# EAGLE schematic motor-nxp-app-notes (EAGLE 6.4)
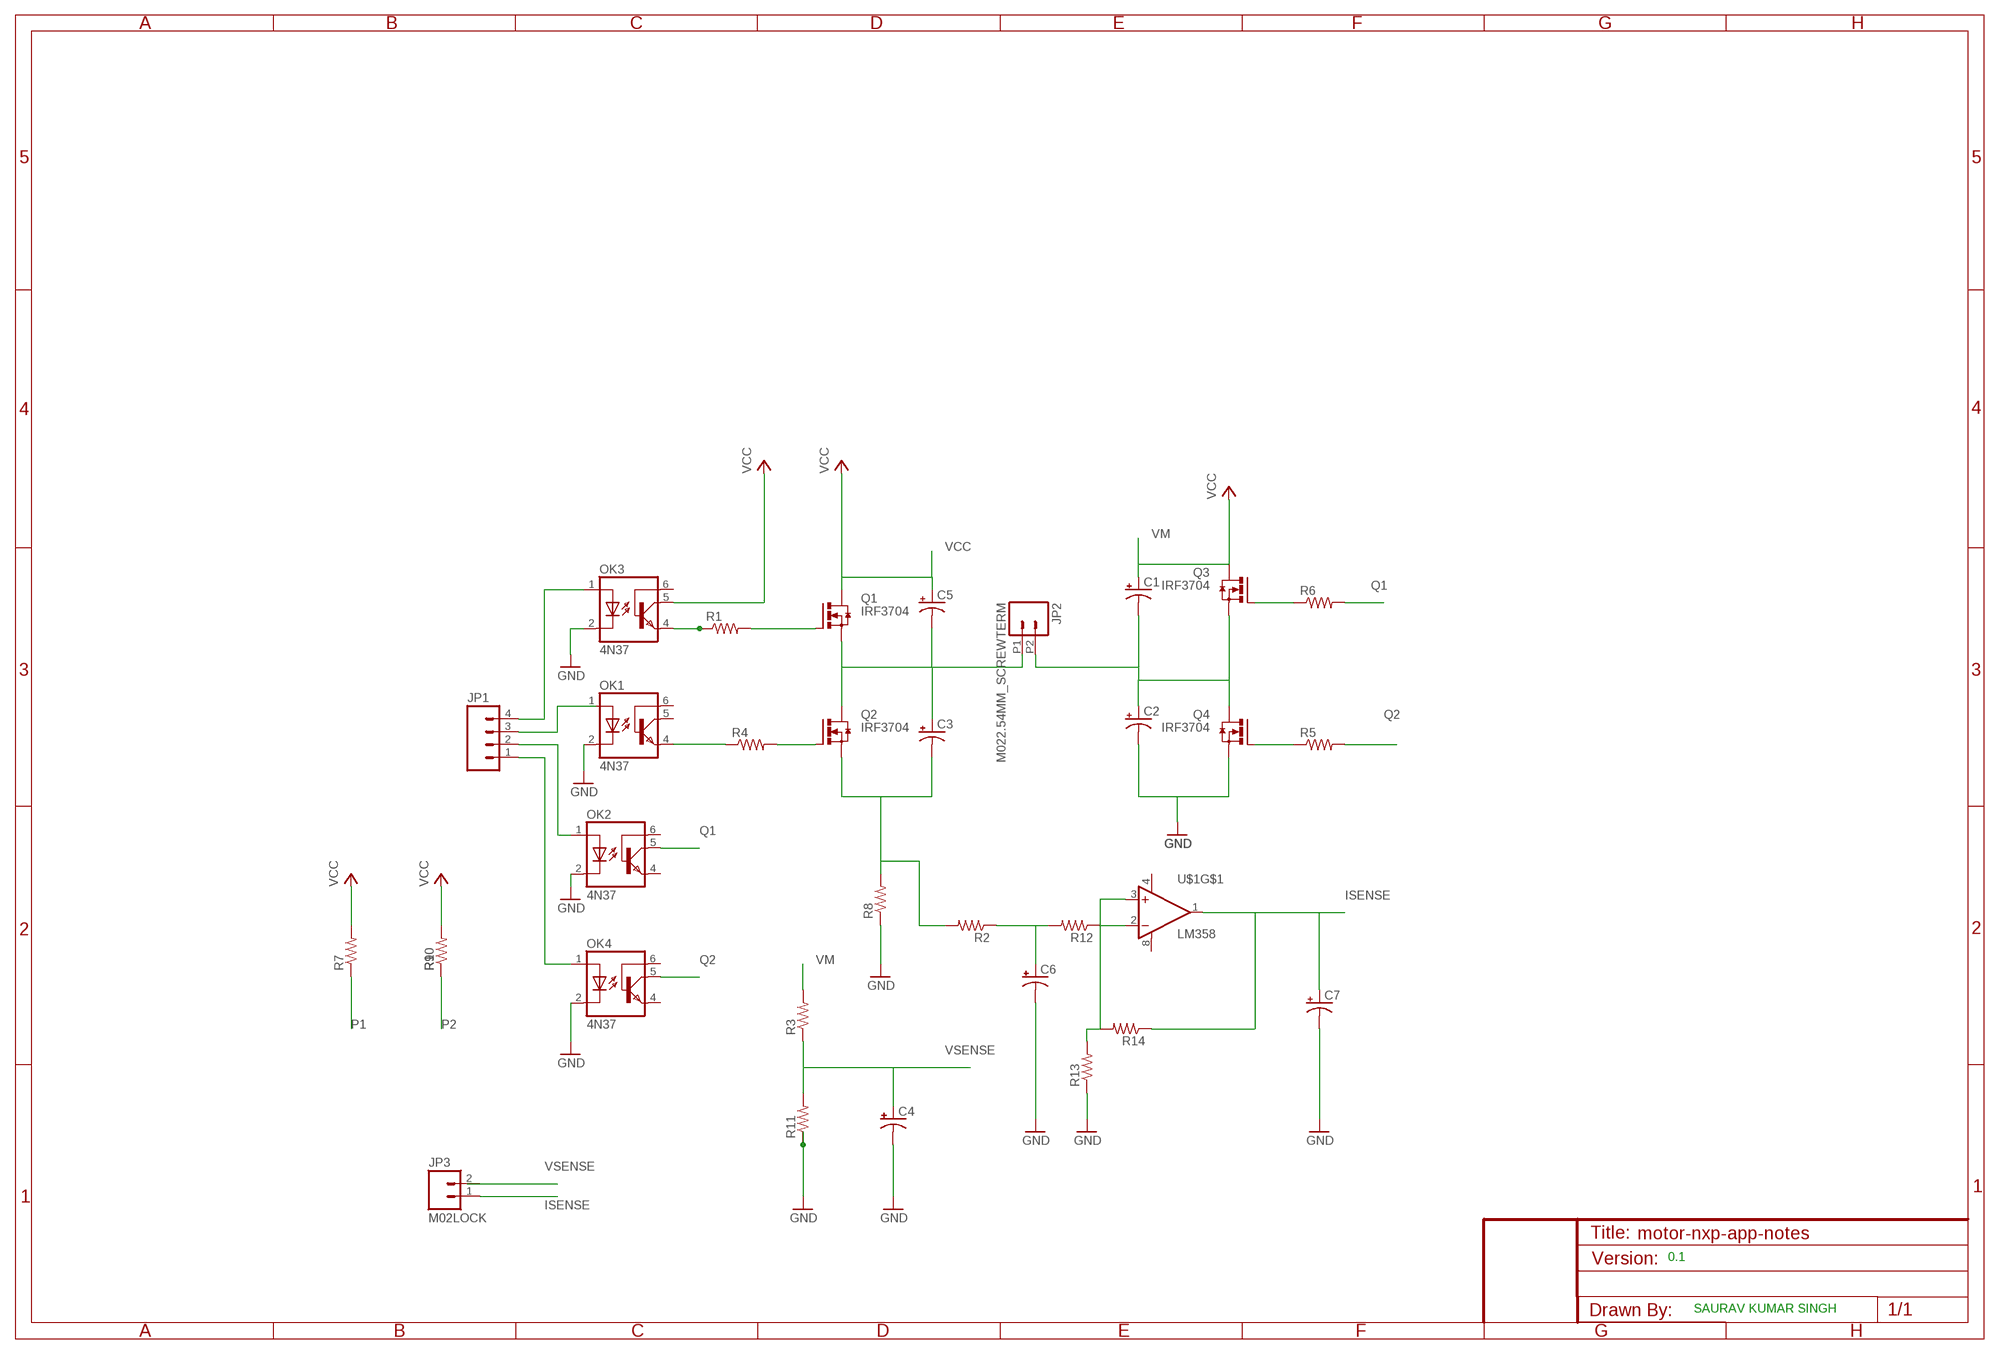
[diagram p0: schematic, sheet 1]

## Parts
C1  CAP_POLPTH1  [CPOL-RADIAL-100UF-25V]
C2  CAP_POLPTH1  [CPOL-RADIAL-100UF-25V]
C3  CAP_POLPTH1  [CPOL-RADIAL-100UF-25V]
C4  CAP_POLPTH1  [CPOL-RADIAL-100UF-25V]
C5  CAP_POLPTH1  [CPOL-RADIAL-100UF-25V]
C6  CAP_POLPTH1  [CPOL-RADIAL-100UF-25V]
C7  CAP_POLPTH1  [CPOL-RADIAL-100UF-25V]
JP1  M04LOCK  [1X04_LOCK]
JP2  M022.54MM_SCREWTERM  [1X02_2.54_SCREWTERM]
JP3  M02LOCK  [1X02_LOCK]
OK1  4N37  [DIL06]
OK2  4N37  [DIL06]
OK3  4N37  [DIL06]
OK4  4N37  [DIL06]
Q1  IRF3704  [TO220AH]
Q2  IRF3704  [TO220AH]
Q3  IRF3704  [TO220AH]
Q4  IRF3704  [TO220AH]
R1  RESISTORPTH-2W  [AXIAL-0.8]
R2  RESISTORPTH-2W  [AXIAL-0.8]
R3  RESISTORPTH-2W  [AXIAL-0.8]
R4  RESISTORPTH-2W  [AXIAL-0.8]
R5  RESISTORPTH-2W  [AXIAL-0.8]
R6  RESISTORPTH-2W  [AXIAL-0.8]
R7  RESISTORPTH-2W  [AXIAL-0.8]
R8  RESISTORPTH-2W  [AXIAL-0.8]
R9  RESISTORPTH-2W  [AXIAL-0.8]
R10  RESISTORPTH-2W  [AXIAL-0.8]
R11  RESISTORPTH-2W  [AXIAL-0.8]
R12  RESISTORPTH-2W  [AXIAL-0.8]
R13  RESISTORPTH-2W  [AXIAL-0.8]
R14  RESISTORPTH-2W  [AXIAL-0.8]
U$1  LM358  [DIP08]

## Nets
GND: C2.2(-) C4.2(-) C6.2(-) C7.2(-) OK1.2(C) OK2.2(C) OK3.2(C) OK4.2(C) Q4.E(S) R8.P$1 R11.P$1 R13.P$1
ISENSE: C7.1(+) JP3.1 R14.P$1 U$1.1(OUT)
N$1: JP1.4 OK3.1(A)
N$2: JP1.3
N$3: JP1.2 OK2.1(A)
N$4: JP1.1 OK4.1(A)
N$5: C3.2(-) Q2.E(S) R2.P$2 R8.P$2
N$6: OK3.4(EMI) R1.P$1
N$7: Q1.B(G) R1.P$2
N$8: C6.1(+) R2.P$1 R12.P$2
N$9: C3.1(+) C5.2(-) JP2.P1 Q1.E(S) Q2.C(D)
N$10: Q2.B(G) R4.P$2
N$11: OK1.4(EMI) R4.P$1
N$12: R12.P$1 U$1.2(-IN)
N$13: R13.P$2 R14.P$2 U$1.3(+IN)
N$19: Q3.B(G) R6.P$1
N$20: Q4.B(G) R5.P$1
N$21: C1.2(-) C2.1(+) JP2.P2 Q3.E(S) Q4.C(D)
P1: R7.P$1
P2: R9.P$1 R10.P$1
Q1: OK2.5(COL) R6.P$2
Q2: OK4.5(COL) R5.P$2
VCC: C5.1(+) OK3.5(COL) Q1.C(D) R7.P$2 R9.P$2 R10.P$2
VM: C1.1(+) Q3.C(D) R3.P$2 ; supply symbol labelled VCC
VSENSE: C4.1(+) R3.P$1 R11.P$2
Unconnected: JP3.2 OK1.1(A) OK1.5(COL) OK1.6(BAS) OK2.4(EMI) OK2.6(BAS) OK3.6(BAS) OK4.4(EMI) OK4.6(BAS) U$1.5(+IN) U$1.6(-IN) U$1.7(OUT)

## Notes on the sheet
- 0.1
- SAURAV KUMAR SINGH

## Power pins joined to a net without a drawn wire
V+: U$1.8(V+)
V-: U$1.4(V-)

## Library data of the parts
C1-C7 = SparkFun-Passives:CAP_POL: Capacitor Polarized These are standard SMD and PTH capacitors. Normally 10uF, 47uF, and 100uF in electrolytic and tantalum varieties. Always verify the external diameter of the through hole cap, it varies with capacity, voltage, and manufacturer. The EIA devices should be standard.
JP1 = SparkFun-Connectors:M04: Header 4 Standard 4-pin 0.1" header. Use with straight break away headers (SKU : PRT-00116), right angle break away headers (PRT-00553), swiss pins (PRT-00743), machine pins (PRT-00117), and female headers (PRT-00115). Molex polarized connector foot print use with SKU : PRT-08231 with associated crimp pins and housings. 1MM SMD Version SKU: PRT-10208
JP2 JP3 = SparkFun-Connectors:M02: Standard 2-pin 0.1" header. Use with - straight break away headers ( PRT-00116) - right angle break away headers (PRT-00553) - swiss pins (PRT-00743) - machine pins (PRT-00117) - female headers (PRT-00115) Molex polarized connector foot print use with: PRT-08233 with associated crimp pins and housings. 2.54_SCREWTERM for use with PRT-10571. 3.5mm Screw Terminal footprints for PRT-08084 5mm Screw Terminal footprints for use with PRT-08433
OK1-OK4 = optocoupler:4N37: OPTO COUPLER Source: http://www.fairchildsemi.com/pf/4N/4N35-M.html; MF: FAIRCHILD SEMICONDUCTOR; MPN: 4N37; OC_FARNELL: 1612456; OC_NEWARK: 72K9948
Q1-Q4 = transistor-power:IRF3704: SMPS MOSFET HEXFET® Power MOSFET Source: http://www.irf.com/product-info/datasheets/data/irf3704.pdf
R1-R14 = SparkFun-Passives:RESISTOR: Resistor Basic schematic elements and footprints for 0603, 1206, and PTH resistors.
U$1 = SparkFun-AnalogIC:LM358: Jellybean op-amp